# EAGLE design Main (EAGLE 8.0.0)

## Sheet 1 of 2
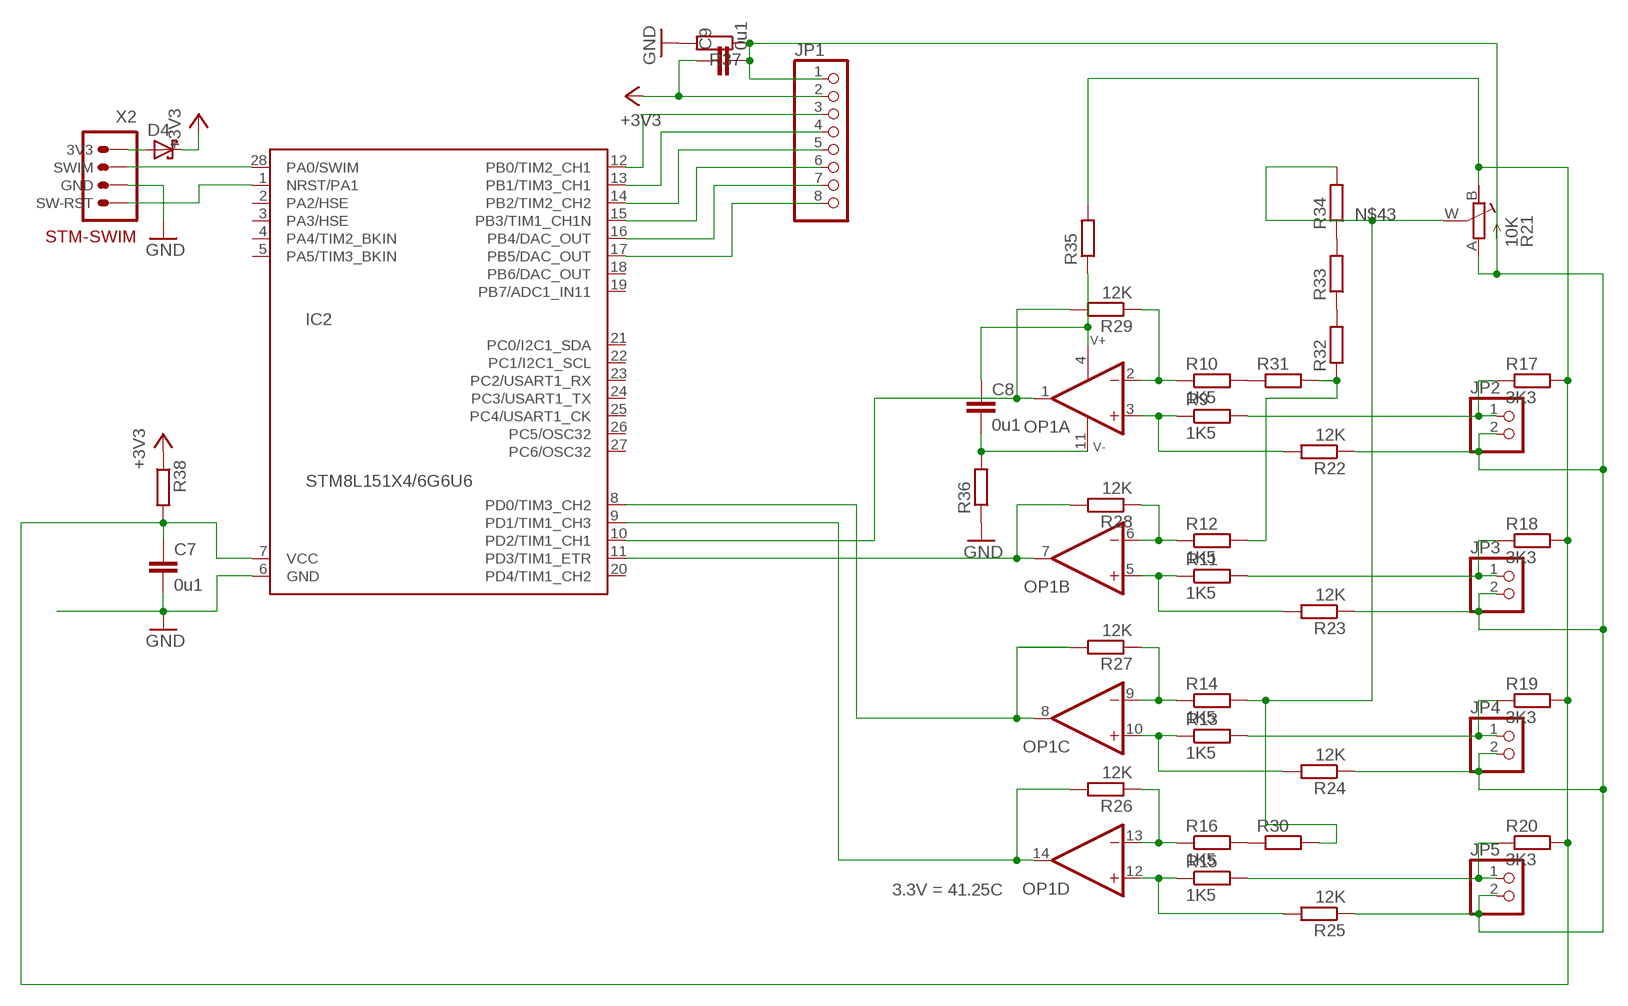
[diagram p0: schematic, sheet 1]

### Parts
C7  0u1  CAP_0805  [C0805]
C8  0u1  CAP_0805  [C0805]
C9  0u1  CAP_0805  [C0805]
D4  DIODE-SH_SOD523  [SOD523]
IC2  STM8L151X4/6G6U6  [QFN28]
JP1  PINHD-1X8  [1X08]
JP2  PINHD-1X2  [1X02]
JP3  PINHD-1X2  [1X02]
JP4  PINHD-1X2  [1X02]
JP5  PINHD-1X2  [1X02]
OP1  OP-AMP-4LMV324IPT  [TSSOP14]
R9  1K5  R_0805  [R0805]
R10  1K5  R_0805  [R0805]
R11  1K5  R_0805  [R0805]
R12  1K5  R_0805  [R0805]
R13  1K5  R_0805  [R0805]
R14  1K5  R_0805  [R0805]
R15  1K5  R_0805  [R0805]
R16  1K5  R_0805  [R0805]
R17  3K3  R_0805  [R0805]
R18  3K3  R_0805  [R0805]
R19  3K3  R_0805  [R0805]
R20  3K3  R_0805  [R0805]
R21  10K  R_POTTURN-X  [RJ9W]
R22  12K  R_0805  [R0805]
R23  12K  R_0805  [R0805]
R24  12K  R_0805  [R0805]
R25  12K  R_0805  [R0805]
R26  12K  R_0805  [R0805]
R27  12K  R_0805  [R0805]
R28  12K  R_0805  [R0805]
R29  12K  R_0805  [R0805]
R30  R_1206  [R1206]
R31  R_1206  [R1206]
R32  R_1206  [R1206]
R33  R_1206  [R1206]
R34  R_1206  [R1206]
R35  R_1206  [R1206]
R36  R_1206  [R1206]
R37  R_1206  [R1206]
R38  R_1206  [R1206]
X2  STM-SWIMPINS  [1X04/90]

### Nets
273: R12.2 R31.2 R32.1
+3V3: C9.1 D4.C JP1.2 R38.1 ; also sheet 2
GND: C7.2 IC2.6(GND) R36.1 R37.2 X2.3(GND) ; also sheet 2
N$11: IC2.10(PD2/TIM1_CH1) OP1.1(A:OUT) R29.2
N$13: IC2.11(PD3/TIM1_ETR) OP1.7(B:OUT) R28.2
N$15: IC2.8(PD0/TIM3_CH2) OP1.8(C:OUT) R27.2
N$16: IC2.9(PD1/TIM1_CH3) OP1.14(D:OUT) R26.2
N$18: IC2.12(PB0/TIM2_CH1) JP1.3
N$20: IC2.13(PB1/TIM3_CH1) JP1.4
N$22: IC2.14(PB2/TIM2_CH2) JP1.5
N$23: IC2.15(PB3/TIM1_CH1N) JP1.6
N$24: IC2.16(PB4/DAC_OUT) JP1.7
N$25: IC2.17(PB5/DAC_OUT) JP1.8
N$26: IC2.28(PA0/SWIM) X2.2(SWIM)
N$27: IC2.1(NRST/PA1) X2.4(SW-RST)
N$28: D4.A X2.1(3V3)
N$29: OP1.3(A:+IN) R9.1 R22.2
N$30: OP1.2(A:-IN) R10.1 R29.1
N$31: R10.2 R31.1
N$32: OP1.6(B:-IN) R12.1 R28.1
N$33: OP1.10(C:+IN) R13.1 R24.2
N$34: OP1.9(C:-IN) R14.1 R27.1
N$35: OP1.12(D:+IN) R15.1 R25.2
N$36: OP1.13(D:-IN) R16.1 R26.1
N$37: JP5.1 R15.2 R20.1
N$38: JP4.1 R13.2 R19.1
N$39: JP3.1 R11.2 R18.1
N$40: JP2.1 R9.2 R17.1
N$41: OP1.5(B:+IN) R11.1 R23.2
N$42: R16.2 R30.1
N$43: R14.2 R21.W(S) R30.2 R34.2
N$44: R32.2 R33.1
N$45: R33.2 R34.1
N$46: C8.1 OP1.4(PW:V+) R35.1
N$47: C8.2 OP1.11(PW:V-) R36.2
N$48: C9.2 JP1.1 JP2.2 JP3.2 JP4.2 JP5.2 R21.A R22.1 R23.1 R24.1 R25.1 R37.1
N$49: C7.1 IC2.7(VCC) R17.2 R18.2 R19.2 R20.2 R21.B(E) R35.2 R38.2
Unconnected: IC2.2(PA2/HSE) IC2.3(PA3/HSE) IC2.4(PA4/TIM2_BKIN) IC2.5(PA5/TIM3_BKIN) IC2.18(PB6/DAC_OUT) IC2.19(PB7/ADC1_IN11) IC2.20(PD4/TIM1_CH2) IC2.21(PC0/I2C1_SDA) IC2.22(PC1/I2C1_SCL) IC2.23(PC2/USART1_RX) IC2.24(PC3/USART1_TX) IC2.25(PC4/USART1_CK) IC2.26(PC5/OSC32) IC2.27(PC6/OSC32)

### Notes on the sheet
- 3.3V = 41.25C

## Sheet 2 of 2
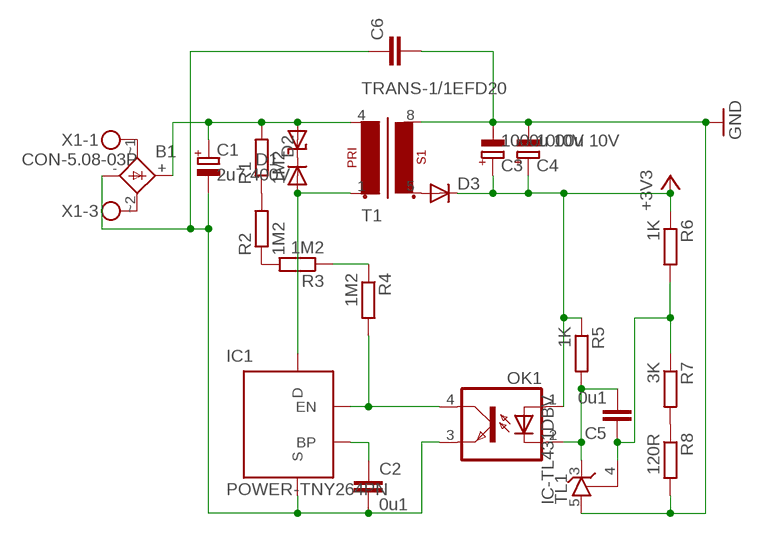
[diagram p1: schematic, sheet 2]

### Parts
B1  RECTIFIERSOIC-8  [SOIC-4]
C1  2u7 400V  CAP-POL_E5-10.5  [E5-10,5]
C2  0u1  CAP_0805  [C0805]
C3  1000u 10V  CAP-POL_E5-10.5  [E5-10,5]
C4  1000u 10V  CAP-POL_E5-10.5  [E5-10,5]
C5  0u1  CAP_0805  [C0805]
C6  CAP_C50-024X044  [C050-024X044]
D1  SUPRESSORDO-204AC  [DO15-12]
D2  DIODE_ES1J  [DO214AC]
D3  DIODE_ES1J  [DO214AC]
IC1  POWER-TNY264PN  [DIP-8B]
OK1  OPTOTRANSPC817  [DIL04]
R1  1M2  R_0805  [R0805]
R2  1M2  R_0805  [R0805]
R3  1M2  R_0805  [R0805]
R4  1M2  R_0805  [R0805]
R5  1K  R_0805  [R0805]
R6  1K  R_0805  [R0805]
R7  3K  R_0805  [R0805]
R8  120R  R_0805  [R0805]
T1  TRANS-1/1EFD20  [EFD20_8PIN]
TL1  IC-TL431DBV  [SOT23-5L]
X1  CON-5.08-03P  [MKDSN1,5/3-5,08]

### Nets
+3V3: C3.+ C4.+ D3.C OK1.1(A) R5.1 R6.1 ; also sheet 1
GND: C3.- C4.- C6.2 R8.2 T1.8(S1-2) TL1.5(A) ; also sheet 1
N$1: B1.~1(AC1) X1.1
N$2: B1.~2(AC2) X1.3
N$3: B1.+ C1.+ D1.A R1.2 T1.4(P1-2)
N$4: B1.- C1.- C2.2 C6.1 IC1.2(S) IC1.3(S) IC1.7(S) IC1.8(S) OK1.3(EMIT)
N$5: D1.C D2.C
N$6: D2.A IC1.5(D) T1.1(P1-1)
N$7: R1.1 R2.2
N$8: R2.1 R3.2
N$9: R3.1 R4.1
N$10: IC1.4(EN) OK1.4(COL) R4.2
N$12: C2.1 IC1.1(BP)
N$14: D3.A T1.5(S1-1)
N$17: C5.2 OK1.2(C) R5.2 TL1.3(C)
N$19: C5.1 R6.2 R7.1 TL1.4(R)
N$21: R7.2 R8.1
Unconnected: X1.2

## Library data of the parts
B1 = Namenlos:RECTIFIER: DIOTEC RECTIFIER
C1 C3 C4 = Namenlos:CAP-POL_
C2 C5-C9 = Namenlos:CAP_
D1 = Namenlos:SUPRESSOR
D2 D3 = Namenlos:DIODE_
D4 = Namenlos:DIODE-SH_
IC1 = Namenlos:POWER-TNY264PN
IC2 = Namenlos:STM8L151X4/6
JP1 = pinhead:PINHD-1X8: PIN HEADER
JP2-JP5 = pinhead:PINHD-1X2: PIN HEADER
OK1 = Namenlos:OPTOTRANS: SHARP OPTO COUPLER; MPN: PC817X4J000F; OC_FARNELL: 9707727; OC_NEWARK: 97K7059
OP1 = Namenlos:OP-AMP-4
R1-R20 R22-R38 = Namenlos:R_
R21 = Namenlos:R_POT
T1 = Namenlos:TRANS-1/1
TL1 = Namenlos:IC-TL431
X1 = Namenlos:CON-5.08-03P: MKDSN 1,5/ 3-5,08 Printklemme Nennstrom: 13,5 A Nennspannung: 250 V Rastermaß: 5,08 mm Polzahl: 3 Anschlussart: Schraubanschluss Montage: Löten Anschlussrichtung Leiter/Platine: 0 ° Artikelnummer: 1729131 Source: http://eshop.phoenixcontact.com .. 1729131.pdf
X2 = Namenlos:STM-SWIM

## Board
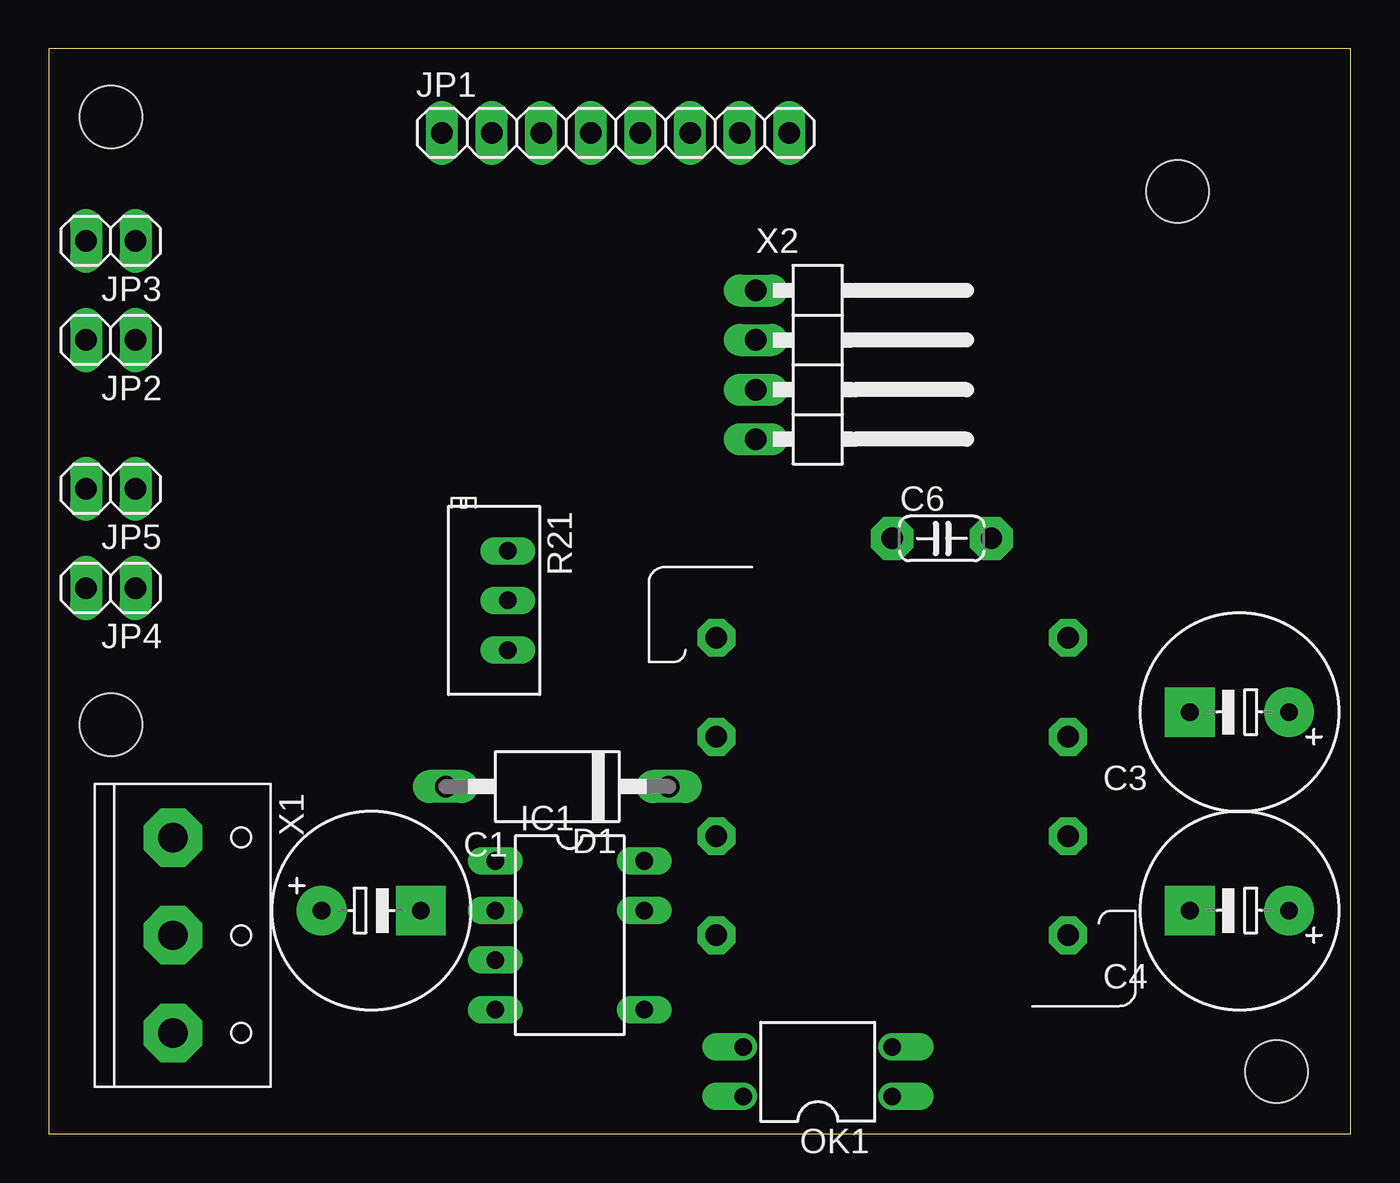
[diagram p2: board, top side]
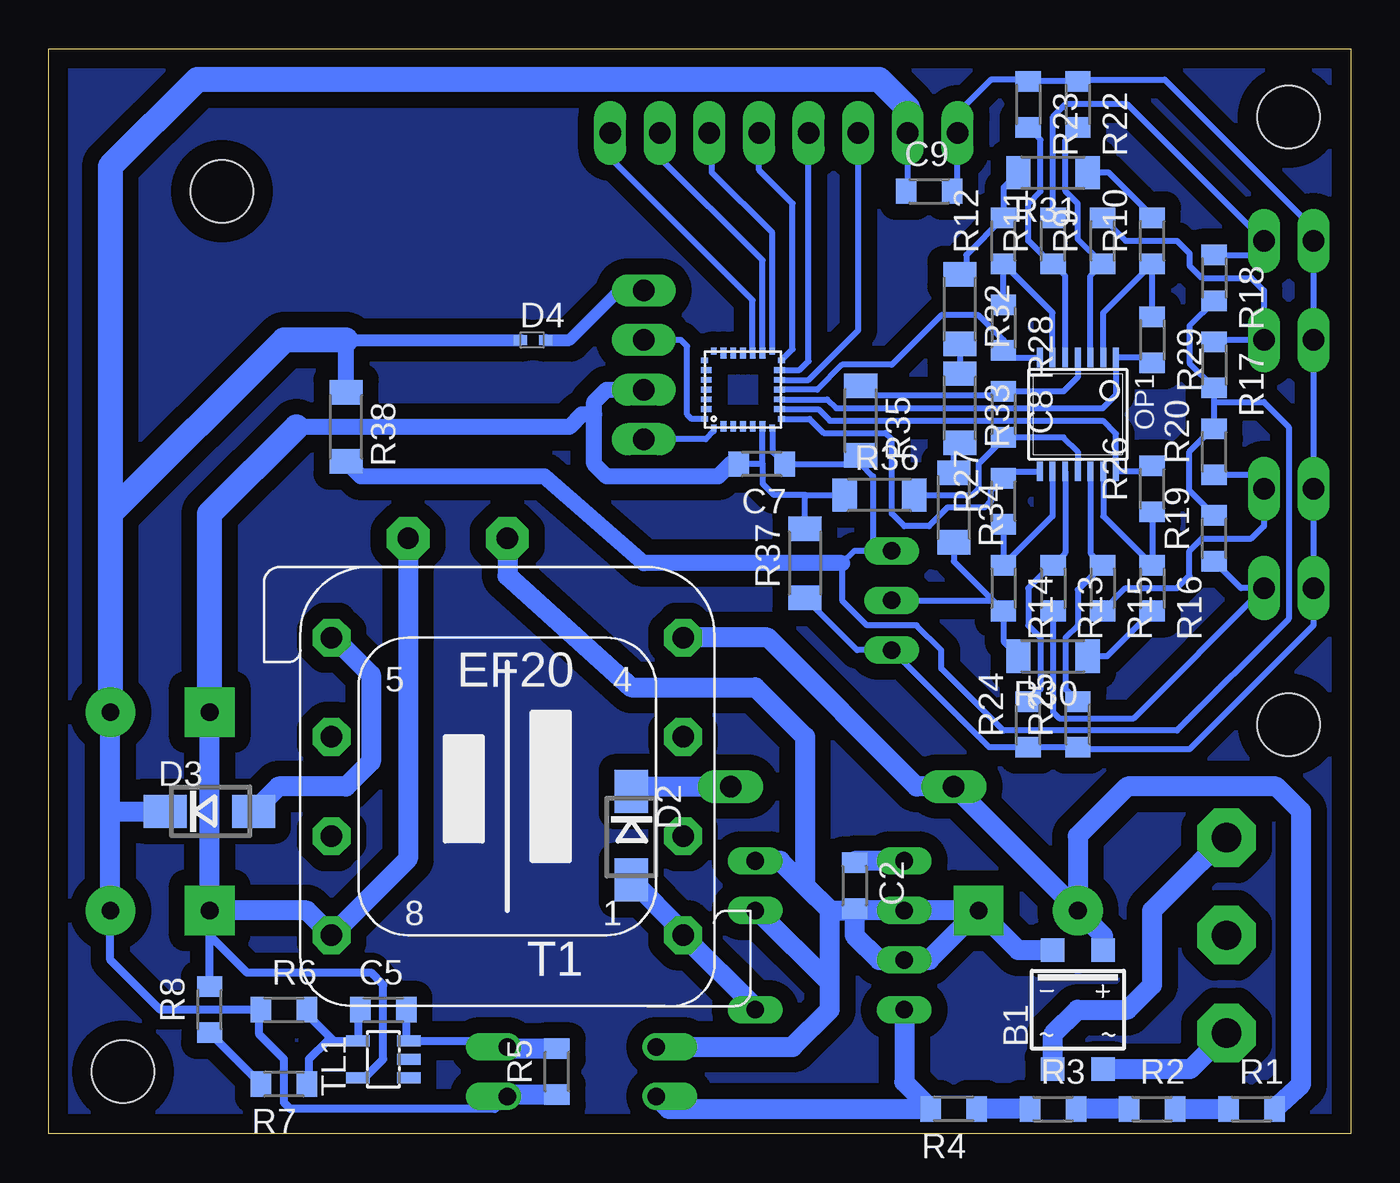
[diagram p3: board, bottom side, seen from below]

Size 66.66 x 55.55 mm. Coordinates in mm from the lower left corner, seen from the top.
Outline: 0,0 66.66,0 66.66,55.55 0,55.55 0,0
Copper layers (1*16): Top 0.035mm / dielectric 1.5mm / Bottom 0.035mm
Design rules "EagleDesignRules": minimum track width 0.2mm, minimum drill 0.3mm, track to track 0.2mm, track to pad 0.2mm, pad to pad 0.2mm, via to via 0.2mm, smd to smd 0.2mm, copper to edge 1mm, drill to drill 0.2mm, minimum pad ring 10mil, minimum via ring 8mil, stop-mask expansion 4mil, vias tented up to drill 0mil, thermal gap 0.25mm
Holes 3.2 mm at 3.17,20.95 62.87,3.17 57.79,48.26 3.17,52.07

### Footprints (pad centres in the part's own frame; a part is rotated, then mirrored left to right if it is on the bottom)
SOIC-4 = smd 1.2 x 1.2: + 1.3,3.05; - -1.3,3.05; ~1 -1.3,-3.05; ~2 1.3,-3.05
E5-10,5 = drill 0.9 pad 2.54: + -2.54,0 | drill 0.9 pad 2.54 square: - 2.54,0
C0805 = smd 1.05 x 1.3: 1 -1.175,0; 2 1.175,0
C050-024X044 = drill 1.1 pad 2.184 octagon: 1 -2.54,0; 2 2.54,0
DO15-12 = drill 1.1 pad 1.676 long: A 5.08,0; C -6.35,0
DO214AC = smd 2.2 x 1.7: A 2.25,0; C -2.285,0
SOD523 = smd 0.7 x 0.5: A 0.7,0; C -0.6,0
DIP-8B = drill 0.9 long: 1 -3.81,-3.81; 2 -1.27,-3.81; 3 1.27,-3.81; 4 3.81,-3.81; 5 3.81,3.81; 7 -1.27,3.81; 8 -3.81,3.81
QFN28 = smd 0.35 x 0.29: 1 -1.975,1.5; 7 -1.975,-1.5; 15 1.975,-1.5; 21 1.975,1.5 | smd 0.55 x 0.29: 2 -1.875,1; 3 -1.875,0.5; 4 -1.875,0; 5 -1.875,-0.5; 6 -1.875,-1; 16 1.875,-1; 17 1.875,-0.5; 18 1.875,0; 19 1.875,0.5; 20 1.875,1 | smd 0.29 x 0.35: 8 -1.5,-1.975; 14 1.5,-1.975; 22 1.5,1.975; 28 -1.5,1.975 | smd 0.29 x 0.55: 9 -1,-1.875; 10 -0.5,-1.875; 11 0,-1.875; 12 0.5,-1.875; 13 1,-1.875; 23 1,1.875; 24 0.5,1.875; 25 0,1.875; 26 -0.5,1.875; 27 -1,1.875
1X08 = drill 1.1 long: 1 -8.89,0; 2 -6.35,0; 3 -3.81,0; 4 -1.27,0; 5 1.27,0; 6 3.81,0; 7 6.35,0; 8 8.89,0
1X02 = drill 1.1 long: 1 -1.27,0; 2 1.27,0
DIL04 = drill 0.9 pad 1.27 offset: 1 -1.27,-3.81; 2 1.27,-3.81; 3 1.27,3.81; 4 -1.27,3.81
TSSOP14 = smd 0.305 x 0.991: 1 -1.95,-2.918; 2 -1.3,-2.918; 3 -0.65,-2.918; 4 0,-2.918; 5 0.65,-2.918; 6 1.3,-2.918; 7 1.95,-2.918; 8 1.95,2.918; 9 1.3,2.918; 10 0.65,2.918; 11 0,2.918; 12 -0.65,2.918; 13 -1.3,2.918; 14 -1.95,2.918
R0805 = smd 1.05 x 1.3: 1 -1.175,0; 2 1.175,0
RJ9W = drill 0.9 long: A 2.54,0.635; B -2.54,0.635; W 0,0.635
R1206 = smd 1.25 x 1.7: 1 -1.775,0; 2 1.775,0
EFD20_8PIN = drill 1.1 pad 1.93 octagon: 1 -9,7.62; 2 -9,2.54; 3 -9,-2.54; 4 -9,-7.62; 5 9,-7.62; 6 9,-2.54; 7 9,2.54; 8 9,7.62
SOT23-5L = smd 0.55 x 1.2: 1 -0.95,-1.3; 2 0,-1.3; 3 0.95,-1.3; 4 0.95,1.3; 5 -0.95,1.3
MKDSN1,5/3-5,08 = drill 1.5 pad 3 octagon: 1 -5,0; 2 0,0; 3 5,0
1X04/90 = drill 1.1 long: 1 -3.81,-3.81; 2 -1.27,-3.81; 3 1.27,-3.81; 4 3.81,-3.81

### Placement (x,y rotation side)
B1  13.97,6.35 0 bottom
C1  16.51,11.43 0 top
C2  25.4,12.7 270 bottom
C3  60.96,21.59 180 top
C4  60.96,11.43 180 top
C5  49.53,6.35 0 bottom
C6  45.72,30.48 0 top
C7  30.16,34.29 180 bottom
C8  17.78,36.83 270 bottom
C9  21.59,48.26 0 bottom
D1  25.4,17.78 180 top
D2  36.83,15.24 270 bottom
D3  58.42,16.51 0 bottom
D4  41.91,40.64 0 bottom
IC1  26.67,10.16 270 top
IC2  31.11,38.1 90 bottom
JP1  29.02,51.25 0 top
JP2  3.17,40.64 180 top
JP3  3.17,45.72 180 top
JP4  3.17,27.94 180 top
JP5  3.17,33.02 180 top
OK1  39.37,3.17 90 top
OP1  13.97,36.83 180 bottom
R1  5.08,1.27 0 bottom
R2  10.16,1.27 0 bottom
R3  15.24,1.27 0 bottom
R4  20.32,1.27 180 bottom
R5  40.64,3.17 90 bottom
R6  54.61,6.35 0 bottom
R7  54.61,2.54 180 bottom
R8  58.42,6.35 90 bottom
R9  12.7,45.72 90 bottom
R10  10.16,45.72 90 bottom
R11  15.24,45.72 90 bottom
R12  17.78,45.72 90 bottom
R13  15.24,27.94 270 bottom
R14  17.78,27.94 270 bottom
R15  12.7,27.94 270 bottom
R16  10.16,27.94 270 bottom
R17  6.98,39.37 270 bottom
R18  6.98,43.81 270 bottom
R19  6.98,30.48 90 bottom
R20  6.98,34.92 90 bottom
R21  22.86,27.3 270 top
R22  13.97,52.7 270 bottom
R23  16.51,52.7 270 bottom
R24  16.51,20.95 90 bottom
R25  13.97,20.95 90 bottom
R26  10.16,33.02 90 bottom
R27  17.78,32.38 90 bottom
R28  17.78,41.27 270 bottom
R29  10.16,40.64 270 bottom
R30  15.24,24.45 180 bottom
R31  15.24,49.21 180 bottom
R32  20,42.23 270 bottom
R33  20,37.15 270 bottom
R34  20.32,32.07 270 bottom
R35  25.08,36.51 270 bottom
R36  24.13,32.7 0 bottom
R37  27.94,29.21 90 bottom
R38  51.44,36.2 270 bottom
T1  43.18,17.78 180 bottom
TL1  49.53,3.81 90 bottom
X1  6.35,10.16 270 top
X2  40.01,39.37 270 top

### Tracks (layer width: path | path; a pad name or v marks a point on that pad's centre or on a via)
273
  Bottom 0.305: R31.2 17.78,48.45 R12.2 19.68,44.99 19.68,44.32 R32.1
+3V3
  Bottom 0.305: 22.77,51.16 JP1.2 22.67,48.35 C9.1
  Bottom 0.406: OK1.1 43.82,1.27 54.29,1.27 54.61,1.59 54.61,3.81 55.88,5.08 55.88,6.25 R6.1 60.96,6.35 63.5,8.89 C4.+
  Bottom 0.61: 51.44,40.64 D4.C
  Bottom 0.813: R38.1 51.44,40.64
  Bottom 1.016: R5.1 43.09,2 OK1.1 | 63.5,16.51 D3.C | 63.5,16.51 C3.+ | C4.+ 63.5,16.51
  Bottom 1.27: 63.5,31.75 C3.+ | 51.44,40.64 54.61,40.64 63.5,31.75 | JP1.2 22.67,52.52 24.13,53.98 59.05,53.98 63.5,49.53 63.5,31.75
GND
  Bottom 0.305: 27.94,32.7 R36.1 | 27.94,32.7 29.53,32.7 30.11,33.29 30.11,34.29 | 30.11,34.29 IC2.6 | 30.11,34.29 C7.2 31.11,34.29 | R37.2 27.94,32.7
  Bottom 0.406: TL1.5 50.48,2.86 49.53,3.81 49.53,7.62 50.17,8.26 56.52,8.26 58.42,10.16 | 58.42,10.16 C4.- | R8.2 58.42,10.16
  Bottom 0.813: X2.3 38.1,38.1 38.74,37.47 38.74,36.83 | C7.2 31.75,34.29 32.38,33.66 38.1,33.66 38.74,34.29 38.74,36.83 | 38.74,36.83 39.37,36.83 40.01,36.2 53.98,36.2
  Bottom 1.016: C6.2 48.26,14.08 T1.8 53.45,11.43 C4.- C3.-
  Bottom 1.27: C3.- 58.42,31.75 53.98,36.2
N$1
  Bottom 1.016: B1.~1 15.24,3.33 15.24,5.08 13.97,6.35 11.43,6.35 10.16,7.62 10.16,11.43 7.7,13.89 X1.1
N$2
  Bottom 1.016: X1.3 8.21,3.3 B1.~2
N$3
  Bottom 1.016: B1.+ 12.67,10.13 C1.+ | C1.+ D1.A 22.22,17.78 29.84,25.4 T1.4 | R1.2 2.54,2.54 2.54,16.51 3.81,17.78 11.43,17.78 13.97,15.24 C1.+
N$4
  Bottom 1.016: B1.- 17.02,9.4 C1.- | OK1.3 28.57,4.45 26.67,6.35 26.67,7.71 | C1.- IC1.2 25.3,11.43 C2.2 | C1.- 21.59,8.89 IC1.3 24.13,8.89 25.4,10.16 C2.2 | IC1.7 30.38,11.43 26.67,7.71 | IC1.8 29.21,13.97 27.94,12.7 | 26.67,7.71 26.67,11.43 | 27.94,12.7 26.67,11.43 | 26.67,11.43 25.5,11.43 C2.2 | C6.1 43.18,28.57 36.83,22.86 30.48,22.86 27.94,20.32 27.94,12.7
N$5
  Bottom 1.016: D2.C 36.58,17.78 D1.C
N$6
  Bottom 1.016: IC1.5 30.48,6.46 T1.1 34.18,10.34 D2.A
N$7
  Bottom 1.016: R2.2 R1.1
N$8
  Bottom 1.016: R2.1 R3.2
N$9
  Bottom 1.016: R3.1 R4.1
N$10
  Bottom 1.016: R4.2 21.59,1.27 | IC1.4 22.86,2.63 R4.2 | OK1.4 34.93,1.27 R4.2
N$11
  Bottom 0.305: R29.2 10.44,39.75 OP1.1 12.02,37.83 12.7,37.15 26.35,37.15 26.8,37.6 IC2.10
N$12
  Bottom 1.016: IC1.1 25.3,13.97 C2.1
N$13
  Bottom 0.305: OP1.7 17.5,39.75 R28.2 | 17.88,40.01 R28.2 | R28.2 17.78,40.64 19.05,41.91 20.95,41.91 23.5,39.37 26.04,39.37 27.3,38.1 IC2.11
N$14
  Bottom 1.016: T1.5 52.07,25.4 50.17,23.5 50.17,19.05 51.44,17.78 54.9,17.78 D3.A
N$15
  Bottom 0.305: OP1.8 17.5,33.91 R27.2 | IC2.8 27.71,36.6 26.99,35.88 23.81,35.88 23.5,35.56 23.5,31.75 22.86,31.11 21.59,31.11 20.64,32.07 18.73,32.07 18.41,32.38 18.41,32.92 R27.2 | 17.88,33.66 R27.2 | R27.2 17.88,33.56
N$16
  Bottom 0.305: R26.2 10.44,33.91 OP1.14 12.02,35.83 12.7,36.51 26.67,36.51 27.26,37.1 IC2.9
N$17
  Bottom 0.406: OK1.2 43.5,4.76 TL1.3 48.36,4.88 C5.2
  Bottom 1.016: R5.2 43.09,4.35 OK1.2
N$18
  Bottom 0.305: IC2.12 27.76,38.6 25.21,41.14 JP1.3
N$19
  Bottom 0.406: C5.1 50.83,6.22 TL1.4 52.07,4.76 | 52.07,4.76 52.39,4.76 53.34,3.81 53.34,2.63 R7.1 | R6.2 53.44,6.12 52.07,4.76
N$20
  Bottom 0.305: IC2.13 28.21,39.1 27.75,39.56 JP1.4
N$21
  Bottom 0.406: R7.2 R8.1
N$22
  Bottom 0.305: IC2.14 28.57,40.16 28.57,47.62 30.29,49.34 JP1.5
N$23
  Bottom 0.305: IC2.15 29.61,46.12 32.7,49.21 32.7,51.12 JP1.6
N$24
  Bottom 0.305: IC2.16 30.11,44.72 35.56,50.16 35.56,51.06 JP1.7
N$25
  Bottom 0.305: IC2.17 30.61,42.68 38.1,50.16 38.1,51.06 JP1.8
N$26
  Bottom 0.305: IC2.28 33.74,36.6 33.97,36.83 33.97,40.32 34.29,40.64 X2.2
N$27
  Bottom 0.305: X2.4 33.02,35.56 32.62,35.97 IC2.1
N$28
  Bottom 0.61: D4.A 40.01,40.64 37.47,43.18 X2.1
N$29
  Bottom 0.305: OP1.3 13.32,43.92 R9.1 13.97,45.81 13.97,47.62 14.61,48.26 14.61,50.9 R22.2
N$30
  Bottom 0.305: OP1.2 12.67,42.03 R10.1 R29.1
N$31
  Bottom 0.305: R10.2 10.16,46.99 12.38,49.21 R31.1
N$32
  Bottom 0.305: OP1.6 15.27,42.03 R12.1 R28.1
N$33
  Bottom 0.305: OP1.10 14.62,29.73 R13.1 15.33,29.11 16.51,27.94 16.51,26.04 15.88,25.4 15.88,22.77 R24.2
N$34
  Bottom 0.305: OP1.9 15.27,31.62 R14.1 R27.1
N$35
  Bottom 0.305: OP1.12 13.32,29.73 R15.1 13.97,27.84 13.97,26.04 14.61,25.4 14.61,22.77 R25.2
N$36
  Bottom 0.305: OP1.13 12.67,31.62 R16.1 R26.1
N$37
  Bottom 0.305: R15.2 11.53,27.94 8.89,27.94 8.26,28.57 8.26,29.84 7.62,30.48 5.08,30.48 4.45,31.11 JP5.1 5.17,33.75 R20.1
N$38
  Bottom 0.305: R13.2 15.24,21.59 14.92,21.27 11.11,21.27 JP4.1 5.62,27.94 R19.1
N$39
  Bottom 0.305: R11.2 15.24,52.07 14.61,52.7 11.43,52.7 JP3.1 5.17,44.99 R18.1
N$40
  Bottom 0.305: R9.2 11.53,45.72 8.89,45.72 8.26,45.09 8.26,44.45 7.62,43.81 5.08,43.81 4.45,43.18 JP2.1 6.26,40.64 R17.1
N$41
  Bottom 0.305: OP1.5 14.62,43.92 R11.1 15.33,44.55 16.51,45.72 16.51,47.62 15.88,48.26 15.88,50.9 R23.2
N$42
  Bottom 0.305: R16.2 12.48,24.45 R30.1
N$43
  Bottom 0.305: R30.2 17.78,25.21 R14.2 18.32,27.3 | R21.W 18.32,27.3 | R34.2 20.32,29.3 18.32,27.3
N$44
  Bottom 0.305: R32.2 R33.1
N$45
  Bottom 0.305: R34.1 20.32,35.05 R33.2
N$46
  Bottom 0.305: OP1.4 13.97,38.73 14.7,38.01 C8.1 18,37.78 24.32,37.78 R35.1
N$47
  Bottom 0.305: OP1.11 13.97,34.92 14.7,35.66 C8.2 17.78,35.56 19.05,34.29 19.05,33.02 19.37,32.7 R36.2
N$48
  Bottom 0.305: 16.61,19.78 R24.1 | JP4.2 JP5.2 JP2.2 JP3.2 1.91,46.35 9.53,53.98 13.88,53.98 R22.1 R23.1 16.61,53.98 18.41,53.98 20.13,52.26 JP1.1 20.13,48.54 C9.2 | JP4.2 1.91,27.3 | JP4.2 1.91,26.04 8.26,19.68 13.88,19.68 R25.1 R24.1 | R24.1 18.51,19.78 R21.A 25.27,24.77 R37.1
N$49
  Bottom 0.305: R19.2 8.26,32.92 8.26,34.92 7.08,36.1 R20.2 6.98,37.47 | R18.2 8.26,41.37 8.26,39.47 R17.2 6.98,37.47 | 6.98,37.47 4.45,37.47 3.17,36.2 3.17,26.35 8.89,20.64 17.78,20.64 20.95,23.81 20.95,24.77 22.22,26.04 24.77,26.04 26.04,27.3 26.04,29.21 25.4,29.84 24.13,29.84 | 24.13,29.84 R21.B | IC2.7 29.61,34.92 C7.1 25.53,34.29 R35.2 25.08,34.29 24.45,33.66 24.45,30.16 24.13,29.84
  Bottom 0.813: 26.04,29.21 36.2,29.21 41.28,33.66 50.67,33.66 R38.2
N$50
  pour Bottom (isolate 0.813): 0,0 66.67,0 66.67,55.24 0,55.24